# EAGLE design untitled (EAGLE 9.2.2)
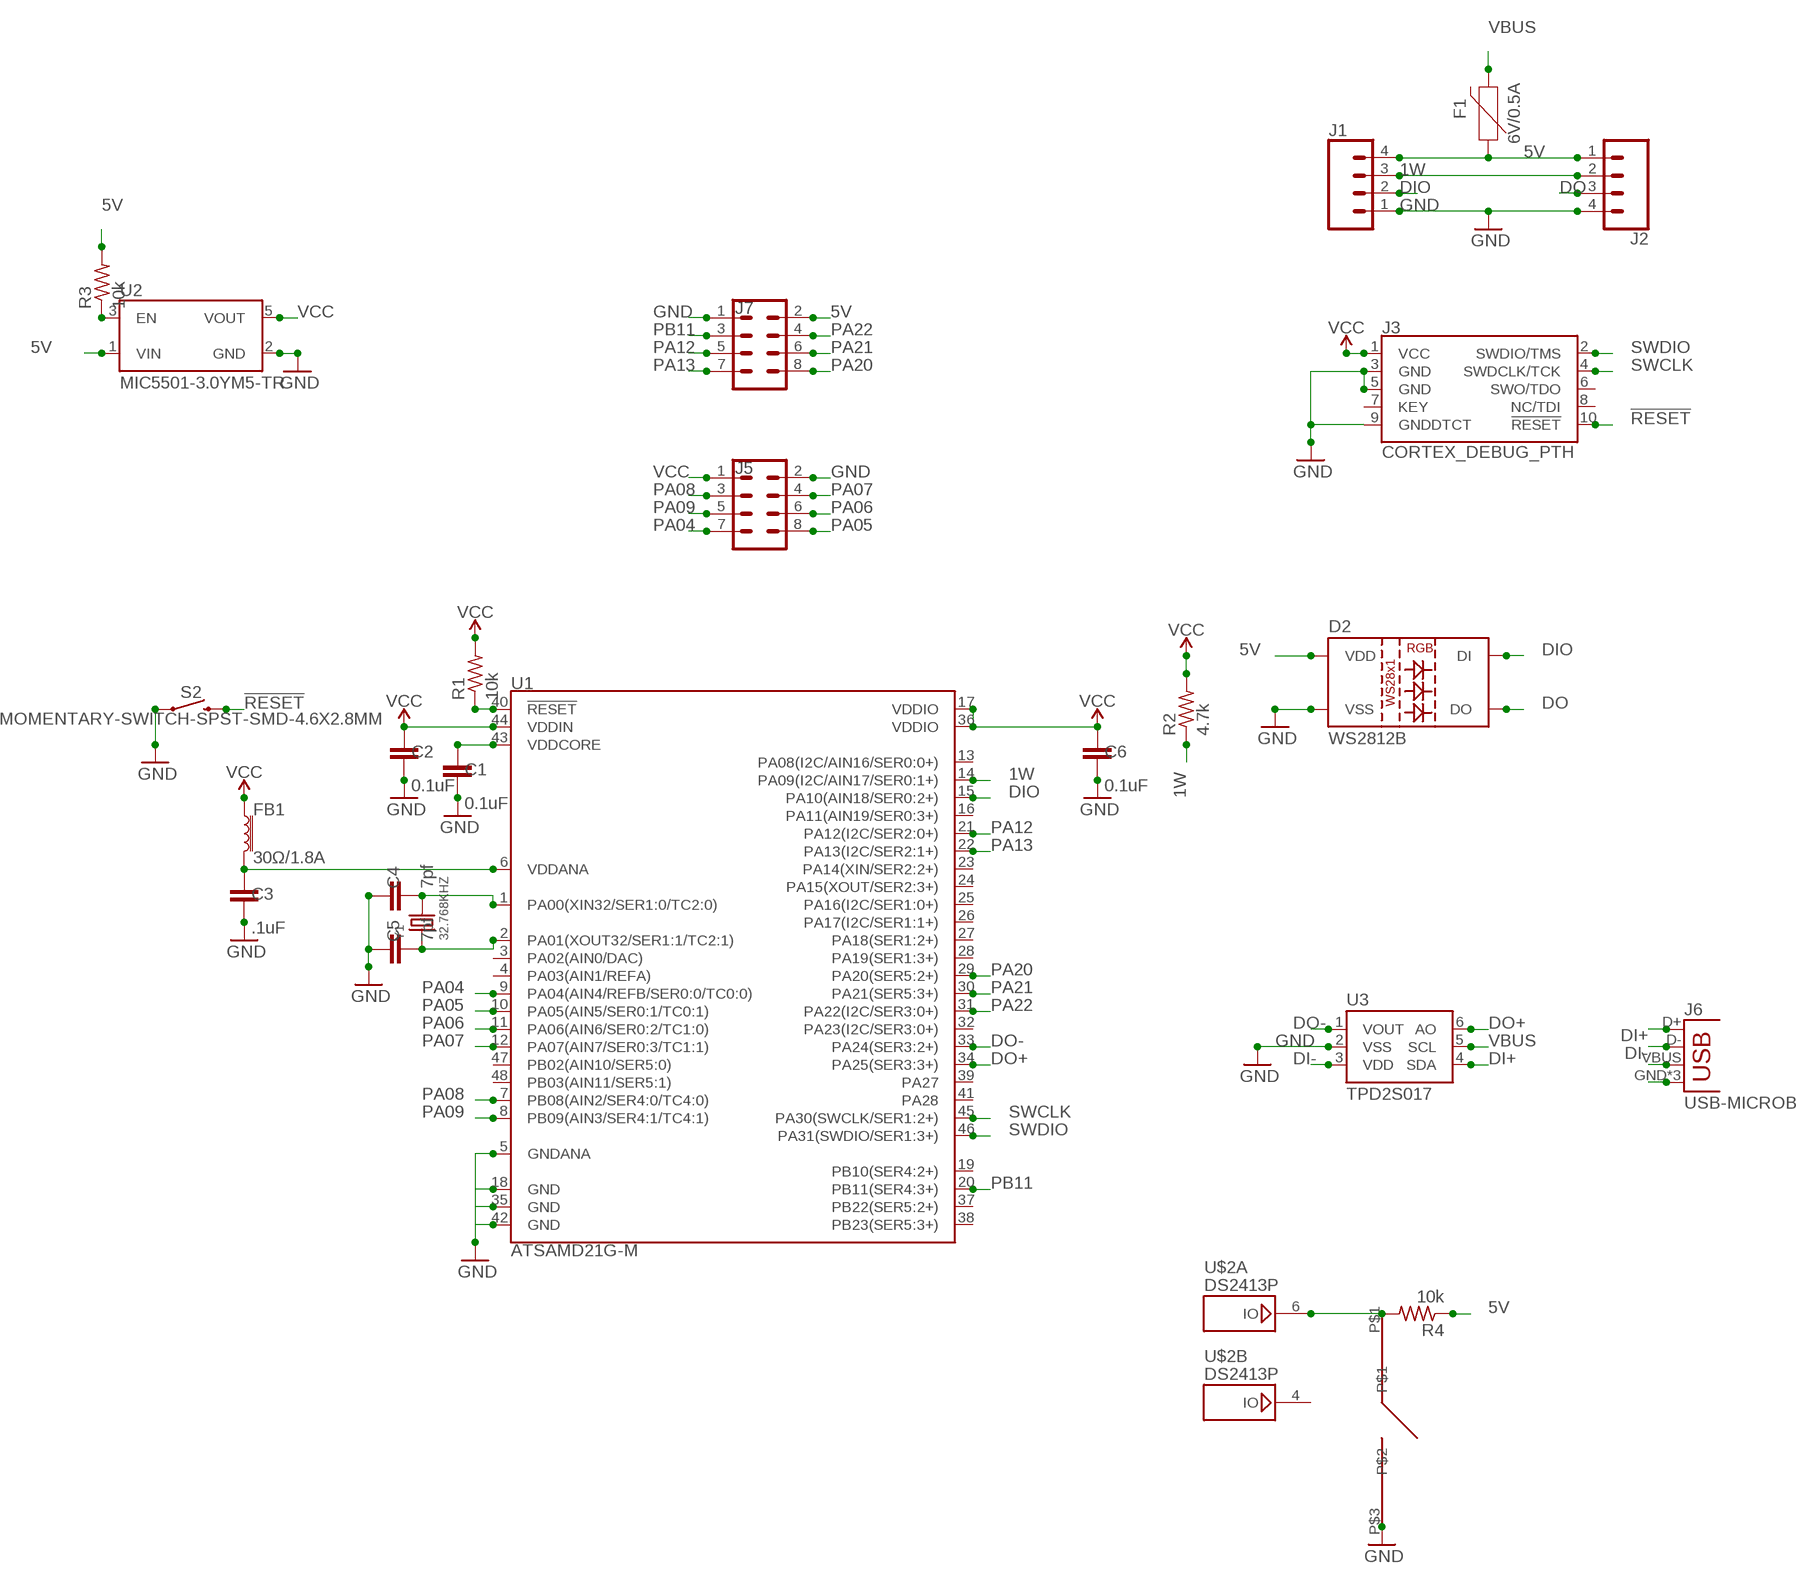
[diagram p0: schematic, sheet 1]

## Parts
C1  0.1uF  0.1UF-0402-16V-10%  [0402]
C2  0.1uF  0.1UF-0402-16V-10%  [0402]
C3  .1uF  0.1UF-0402-16V-10%  [0402]
C4  7pf  0.1UF-0402-16V-10%  [0402]
C5  7pf  0.1UF-0402-16V-10%  [0402]
C6  0.1uF  0.1UF-0402-16V-10%  [0402]
D2  WS2812B  [WS2812B]
F1  6V/0.5A  PPTC_HALF-AMP  [1206]
FB1  30Ω/1.8A  FERRITE_BEAD-0603  [0603]
J1  CONN_04SMD2  [1X04_1MM_RA]
J2  CONN_04SMD2  [1X04_1MM_RA]
J3  CORTEX_DEBUG_PTH  [2X5-PTH-1.27MM]
J5  CONN_04X2  [2X4]
J6  USB-MICROB  [USB-MICROB]
J7  CONN_04X2  [2X4]
R1  10k  R-US_R0402  [R0402]
R2  4.7k  R-US_R0402  [R0402]
R3  10k  R-US_R0402  [R0402]
R4  10k  R-US_R0402  [R0402]
S2  MOMENTARY-SWITCH-SPST-SMD-4.6X2.8MM  [TACTILE_SWITCH_SMD_4.6X2.8MM]
U1  ATSAMD21G-M  [QFN-48]
U2  MIC5501-3.0YM5-TR  [SOT95P280X145-5N]
U3  TPD2S017  MCP4725SOT-23  [SOT23-6]
U$1  NOVELKEY  [NOVELKEY]
U$2  DS2413P  [TSOC6]
Y1  32.768KHZ  SMD-CRYSTAL-ABS07-32.768KHZ-7PF-20PPM-70K(2P-3.2X1.5MM)  [X2-SMD-3.2X1.5X0.55MM]

## Nets
1W: J1.3 J2.2 R2.1 U1.14(PA09(I2C/AIN17/SER0:1+))
5V: D2.1(VDD) F1.1 J1.4 J2.1 J7.2 R3.2 R4.1 U2.1(VIN)
!RESET: J3.10(!RESET) R1.1 S2.3 S2.4 U1.40(!RESET!)
DI+: J6.D+ U3.4(SDA)
DI-: J6.D- U3.3(VDD)
DIO: D2.4(DI) J1.2 U1.15(PA10(AIN18/SER0:2+))
DO: D2.2(DO) J2.3
DO+: U1.34(PA25(SER3:3+)) U3.6(AO)
DO-: U1.33(PA24(SER3:2+)) U3.1(VOUT)
GND: C1.2 C2.2 C3.2 C4.1 C5.1 C6.2 D2.3(VSS) J1.1 J2.4 J3.3(GND) J3.5(GND) J3.9(GNDDTCT) J5.2 J6.GND J6.MT1(GND) J6.MT2(GND) J7.1 S2.1 S2.2 U1.5(GNDANA) U1.18(GND) U1.35(GND) U1.42(GND) U2.2(GND) U3.2(VSS) U$1.P$3
N$1: R3.1 U2.3(EN)
N$4: C3.1 FB1.2 U1.6(VDDANA)
N$10: R4.2 U$1.P$1 U$2.6
N$12: C5.2 U1.2(PA01(XOUT32/SER1:1/TC2:1)) Y1.1
N$13: C4.2 U1.1(PA00(XIN32/SER1:0/TC2:0)) Y1.2
N$14: C1.1 U1.43(VDDCORE)
PA04: J5.7 U1.9(PA04(AIN4/REFB/SER0:0/TC0:0))
PA05: J5.8 U1.10(PA05(AIN5/SER0:1/TC0:1))
PA06: J5.6 U1.11(PA06(AIN6/SER0:2/TC1:0))
PA07: J5.4 U1.12(PA07(AIN7/SER0:3/TC1:1))
PA08: J5.3 U1.7(PB08(AIN2/SER4:0/TC4:0))
PA09: J5.5 U1.8(PB09(AIN3/SER4:1/TC4:1))
PA12: J7.5 U1.21(PA12(I2C/SER2:0+))
PA13: J7.7 U1.22(PA13(I2C/SER2:1+))
PA20: J7.8 U1.29(PA20(SER5:2+))
PA21: J7.6 U1.30(PA21(SER5:3+))
PA22: J7.4 U1.31(PA22(I2C/SER3:0+))
PB11: J7.3 U1.20(PB11(SER4:3+))
SWCLK: J3.4(SWDCLK/TCK) U1.45(PA30(SWCLK/SER1:2+))
SWDIO: J3.2(SWDIO/TMS) U1.46(PA31(SWDIO/SER1:3+))
VBUS: F1.2 J6.VBUS U3.5(SCL)
VCC: C2.1 C6.1 FB1.1 J3.1(VCC) J5.1 R1.2 R2.2 U1.17(VDDIO) U1.36(VDDIO) U1.44(VDDIN) U2.5(VOUT)
Unconnected: J3.6(SWO/TDO) J3.7(KEY) J3.8(NC/TDI) U1.3(PA02(AIN0/DAC)) U1.4(PA03(AIN1/REFA)) U1.13(PA08(I2C/AIN16/SER0:0+)) U1.16(PA11(AIN19/SER0:3+)) U1.19(PB10(SER4:2+)) U1.23(PA14(XIN/SER2:2+)) U1.24(PA15(XOUT/SER2:3+)) U1.25(PA16(I2C/SER1:0+)) U1.26(PA17(I2C/SER1:1+)) U1.27(PA18(SER1:2+)) U1.28(PA19(SER1:3+)) U1.32(PA23(I2C/SER3:0+)) U1.37(PB22(SER5:2+)) U1.38(PB23(SER5:3+)) U1.39(PA27) U1.41(PA28) U1.47(PB02(AIN10/SER5:0)) U1.48(PB03(AIN11/SER5:1)) U$2.4

## Power pins joined to a net without a drawn wire
1W: U$2.2
GND: U$2.1 U$2.5

## Library data of the parts
C1 C2 C6 = SparkFun-Capacitors:0.1UF: 0.1µF ceramic capacitors A capacitor is a passive two-terminal electrical component used to store electrical energy temporarily in an electric field.; PROD_ID: CAP-12416
C3-C5 = SparkFun-Capacitors:0.1UF: 0.1µF ceramic capacitors A capacitor is a passive two-terminal electrical component used to store electrical energy temporarily in an electric field.; PROD_ID: CAP-12416; VALUE: 0.1uF
D2 = SparkFun-LED:WS2812B: WS2812B SMD addressable RGB LED 5x5mm SMD LED with built-in controller IC. Color: Red/Green/Blue mC Rating: RGB: 390, 660, 180 mcd Forward Voltage: RGB: 2.0, 3.0, 3.0 V Packages:WS2812B SparkFun Products: Blynk Board - ESP8266 <https://www.sparkfun.com/products/13794>; PROD_ID: DIO-12503
F1 = SparkFun-Fuses:PPTC: Resettable Fuse PPTC Resettable Fuse. Really a sort of resistor with a polymeric positive temperature coefficient whose resistance increases dramatically with an increase in temperature. When heated by the power passing through the resistance rises causing the current to be limited, protecting the circuit. This is achieved by the transition of the polymer from a crystalline to an amorphous state where the conductive carbon separates breaking the conductive pathways found in the cool crystalline structure. When a PPTC cools back down it resumes conducting letting the circuit turn back on. SparkFun Products: SparkFun RedBoard - Programmed with Arduino <https://www.sparkfun.com/products/12757> Pro Micro - 5V/16MHz <https://www.sparkfun.com/products/12640> Arduino Pro 328 - 5V/16MHz <https://www.sparkfun.com/products/10915> MP3 Trigger <https://www.sparkfun.com/products/13720>; PROD_ID: RES-08585
FB1 = SparkFun-Coils:FERRITE_BEAD: Ferrite Bead (blocks, cores, rings, chokes, etc.) Inductor with layers of ferrite used to suppress high frequencies. Often used to isolate high frequency noise. SparkFun Products: IOIO-OTG - V2.2 <https://www.sparkfun.com/products/13613> SparkFun SAMD21 Mini Breakout <https://www.sparkfun.com/products/13664> SparkFun 6 Degrees of Freedom Breakout - LSM6DS3 <https://www.sparkfun.com/products/13339> SparkFun SAMD21 Dev Breakout <https://www.sparkfun.com/products/13672>; PROD_ID: NDUC-07859
J1 J2 = SparkFun-Connectors:CONN_04: Multi connection point. Often used as Generic Header-pin footprint for 0.1 inch spaced/style header connections On any of the 0.1 inch spaced packages, you can populate with these: Break Away Headers - Straight <https://www.sparkfun.com/products/116> (PRT-00116) Break Away Male Headers - Right Angle <https://www.sparkfun.com/products/553> (PRT-00553) Female Headers <https://www.sparkfun.com/products/115> (PRT-00115) Break Away Headers - Machine Pin <https://www.sparkfun.com/products/117> (PRT-00117) Break Away Female Headers - Swiss Machine Pin <https://www.sparkfun.com/products/743> (PRT-00743) For SCREWTERMINALS and SPRING TERMINALS visit here: Screw Terimnals on SparkFun.com <https://www.sparkfun.com/search/results?term=Screw+Terminals> (5mm/3.5mm/2.54mm spacing) This device is also useful as a general connection point to wire up your design to another part of your project. Our various solder wires solder well into these plated through hole pads. Hook-Up Wire - Assortment (Stranded, 22 AWG) <https://www.sparkfun.com/products/11375> (PRT-11375) Hook-Up Wire - Assortment (Solid Core, 22 AWG) <https://www.sparkfun.com/products/11367> (PRT-11367) View the entire wire category on our website here <https://www.sparkfun.com/categories/141> Special notes: Molex polarized connector foot print use with SKU : PRT-08231 with associated crimp pins and housings. 1MM SMD Version SKU: PRT-10208; PROD_ID: CONN-10310; SF_ID: PRT-10208
J3 = SparkFun-Connectors:CORTEX_DEBUG: Cortex Debug Connector - 10 pin Supports JTAG debug, Serial Wire debug, and Serial Wire Viewer. PTH and SMD connector options available. General Connector Information <http://infocenter.arm.com/help/topic/com.arm.doc.faqs/attached/13634/cortex_debug_connectors.pdf> Products: PTH Connector <http://www.digikey.com/product-detail/en/cnc-tech/3220-10-0100-00/1175-1627-ND/3883661> -via Digi-Key SparkFun PSoc <https://www.sparkfun.com/products/13229> SparkFun T <https://www.sparkfun.com/products/13810>
J5 J7 = SparkFun-Connectors:CONN_04X2: Multi connection point. Often used as Generic Header-pin footprint for 0.1 inch spaced/style header connections On any of the 0.1 inch spaced packages, you can populate with these: Break Away Headers - Straight <https://www.sparkfun.com/products/116> (PRT-00116) Break Away Male Headers - Right Angle <https://www.sparkfun.com/products/553> (PRT-00553) Female Headers <https://www.sparkfun.com/products/115> (PRT-00115) Break Away Headers - Machine Pin <https://www.sparkfun.com/products/117> (PRT-00117) Break Away Female Headers - Swiss Machine Pin <https://www.sparkfun.com/products/743> (PRT-00743)
J6 = SparkFun-Retired:USB: USB Connectors USB-B-PTH is fully proven SKU : PRT-00139/CONN-08278 USB-miniB is fully proven SKU : PRT-00587 USB-A-PCB is untested. USB-A-H is throughly reviewed, but untested. Spark Fun Electronics SKU : PRT-00437 USB-B-SMT is throughly reviewed, but untested. Needs silkscreen touching up. USB-A-S has not been used/tested USB-MB-H has not been used/tested USB-MICROB has been used. CONN-09505; PROD_ID: CONN-09505
R1-R4 = rcl:R-US_: RESISTOR, American symbol; SPICEPREFIX: R
S2 = SparkFun-Switches:MOMENTARY-SWITCH-SPST: Momentary Switch (Pushbutton) - SPST Normally-open (NO) SPST momentary switches (buttons, pushbuttons). Variants PTH-12MM - 12mm square, through-hole Momentary Pushbutton Switch - 12mm Square <https://www.sparkfun.com/products/9190> (COM-09190) PTH-6.0MM, PTH-6.0MM-KIT - 6.0mm square, through-hole Mini Pushbutton Switch <https://www.sparkfun.com/products/97> (COM-00097) KIT package intended for soldering kit's - only one side of pads' copper is exposed. PTH-RIGHT-ANGLE-KIT - Right-angle, through-hole Right Angle Tactile Button <https://www.sparkfun.com/products/10791> - Used on SparkFun BigTime Watch Kit <https://www.sparkfun.com/products/11734> SMD-12MM - 12mm square, surface-mount Tactile Button - SMD (12mm) <https://www.sparkfun.com/products/12993> (COM-12993) Used on SparkFun PicoBoard <https://www.sparkfun.com/products/11888> SMD-4.5MM - 4.5mm Square Trackball Switch Used on SparkFun Blackberry Trackballer Breakout <https://www.sparkfun.com/products/13169> SMD-4.6MMX2.8MM - 4.60mm x 2.80mm, surface mount Used on SparkFun SAMD21 Mini Breakout <https://www.sparkfun.com/products/13664> SMD-5.2MM, SMD-5.2-REDUNDANT - 5.2mm square, surface-mount Mini Pushbutton Switch - SMD <https://www.sparkfun.com/products/8720> (COM-08720) Used on Arduino Pro Mini <https://www.sparkfun.com/products/11114> REDUNDANT package connects both switch circuits together SMD-6.0X3.5MM - 6.0 x 3.5mm, surface mount Momentary Reset Switch SMD <https://www.sparkfun.com/products/8229> (COM-08229) SMD-6.2MM-TALL - 6.2mm square, surface mount Tactile Button - SMD (6mm) <https://www.sparkfun.com/products/12992> Used on SparkFun Digital Sandbox <https://www.sparkfun.com/products/12651> SMD-RIGHT-ANGLE - Right-angle, surface mount Used on SparkFun Block for Intel® Edison - Arduino <https://www.sparkfun.com/products/13036>; PROD_ID: SWCH-13065
U1 = SparkFun-IC-Microcontroller:ATSAMD21G: Atmel SAMD21G SMART ARM-Based Microcontroller The Atmel ® | SMART ™ SAM D21 is a series of low-power microcontrollers using the 32-bit ARM ® Cortex ® -M0+ processor, and ranging from 32- to 64-pins with up to 256KB Flash and 32KB of SRAM. The SAM D21 devices operate at a maximum frequency of 48MHz and reach 2.46 CoreMark/MHz. They are designed for simple and intuitive migration with identical peripheral modules, hex compatible code, identical linear address map and pin compatible migration paths between all devices in the product series. All devices include intelligent and flexible peripherals, Atmel Event System for inter-peripheral signaling, and support for capacitive touch button, slider and wheel user interfaces. Datasheet <https://cdn.sparkfun.com/datasheets/Dev/Arduino/Boards/Atmel-42181-SAM-D21_Datasheet.pdf> SparkFun Products SparkFun SAMD21 Mini Breakout <https://www.sparkfun.com/products/13664> (DEV-13664) SparkFun SAMD21 Dev Breakout <https://www.sparkfun.com/products/13672> (DEV-13672); PROD_ID: IC-13064
U2 = MIC5501-3.0YM5-TR:MIC5501-3.0YM5-TR: General Purpose Single 300mA LDO, 5 SOT-23 T/R; AVAILABILITY: Unavailable; DESCRIPTION: General Purpose Single 300mA LDO, 5 SOT-23 T/R; MF: Microchip; MP: MIC5501-3.0YM5-TR; PACKAGE: SOT-23 Microchip; PRICE: None
U3 = SparkFun-IC-Conversion:MCP4725: MCP4725 DAC Microchip 12-bit I2C DAC, SOT23-6 Datasheet <https://cdn.sparkfun.com/datasheets/BreakoutBoards/MCP4725_2009.pdf> SparkFun Products SparkFun I2C DAC Breakout - MCP4725 <https://www.sparkfun.com/products/12918> (BOB-12918); PROD_ID: IC-08886; VALUE: MCP4725
U$1 = novelkey:NOVELKEY: Novelkey giant MX key
U$2 = 1wire:DS2413: Dual Channel Addressable Switch This chip is similar to the DS2405 chip, but provides two PIO channels with 20mA sinking capability and an on-resistance of 20Ohm for each open drain output. Up to 28V can be switched. Note: Both GND pins must be connected to 0V. Author: Jan Kandziora <jjj@gmx.de>
Y1 = Seeed-Crystal Oscillator:SMD-CRYSTAL-ABS07-32.768KHZ-7PF-20PPM-70K(2P-3.2X1.5MM): 306010055; MPN: FC-135

## Board
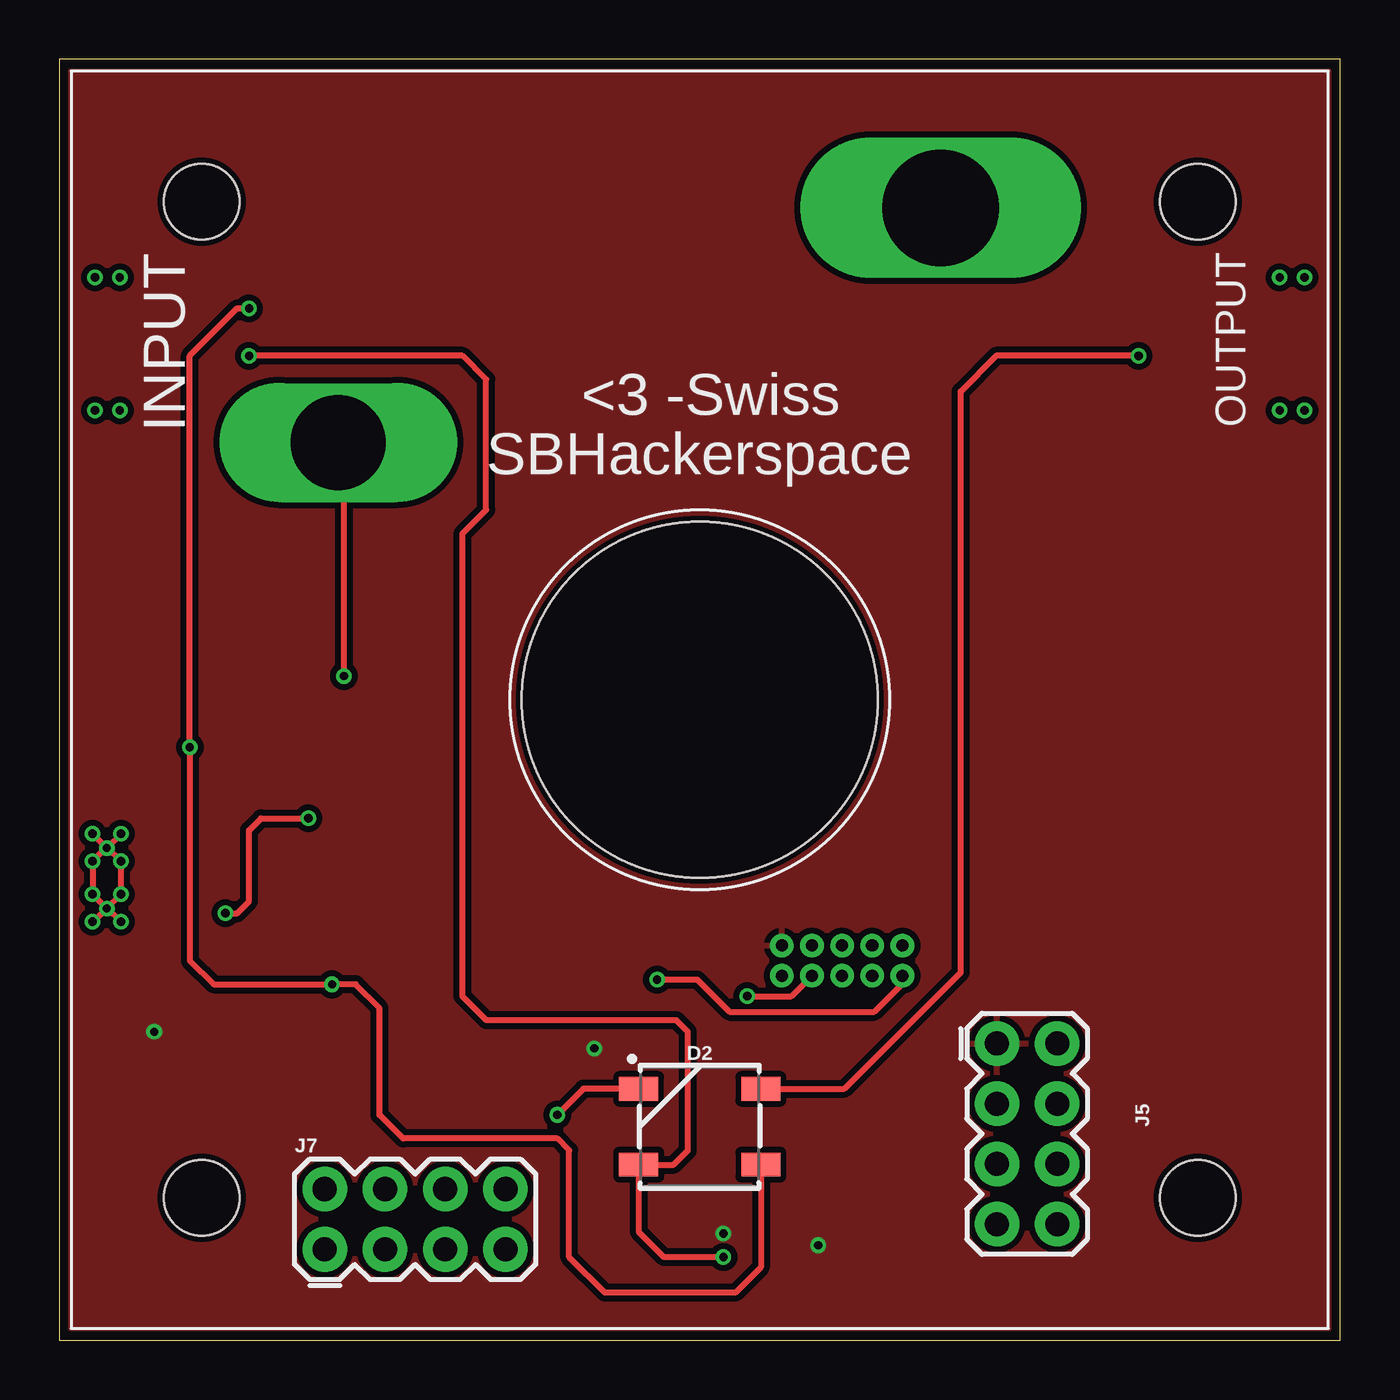
[diagram p1: board, top side]
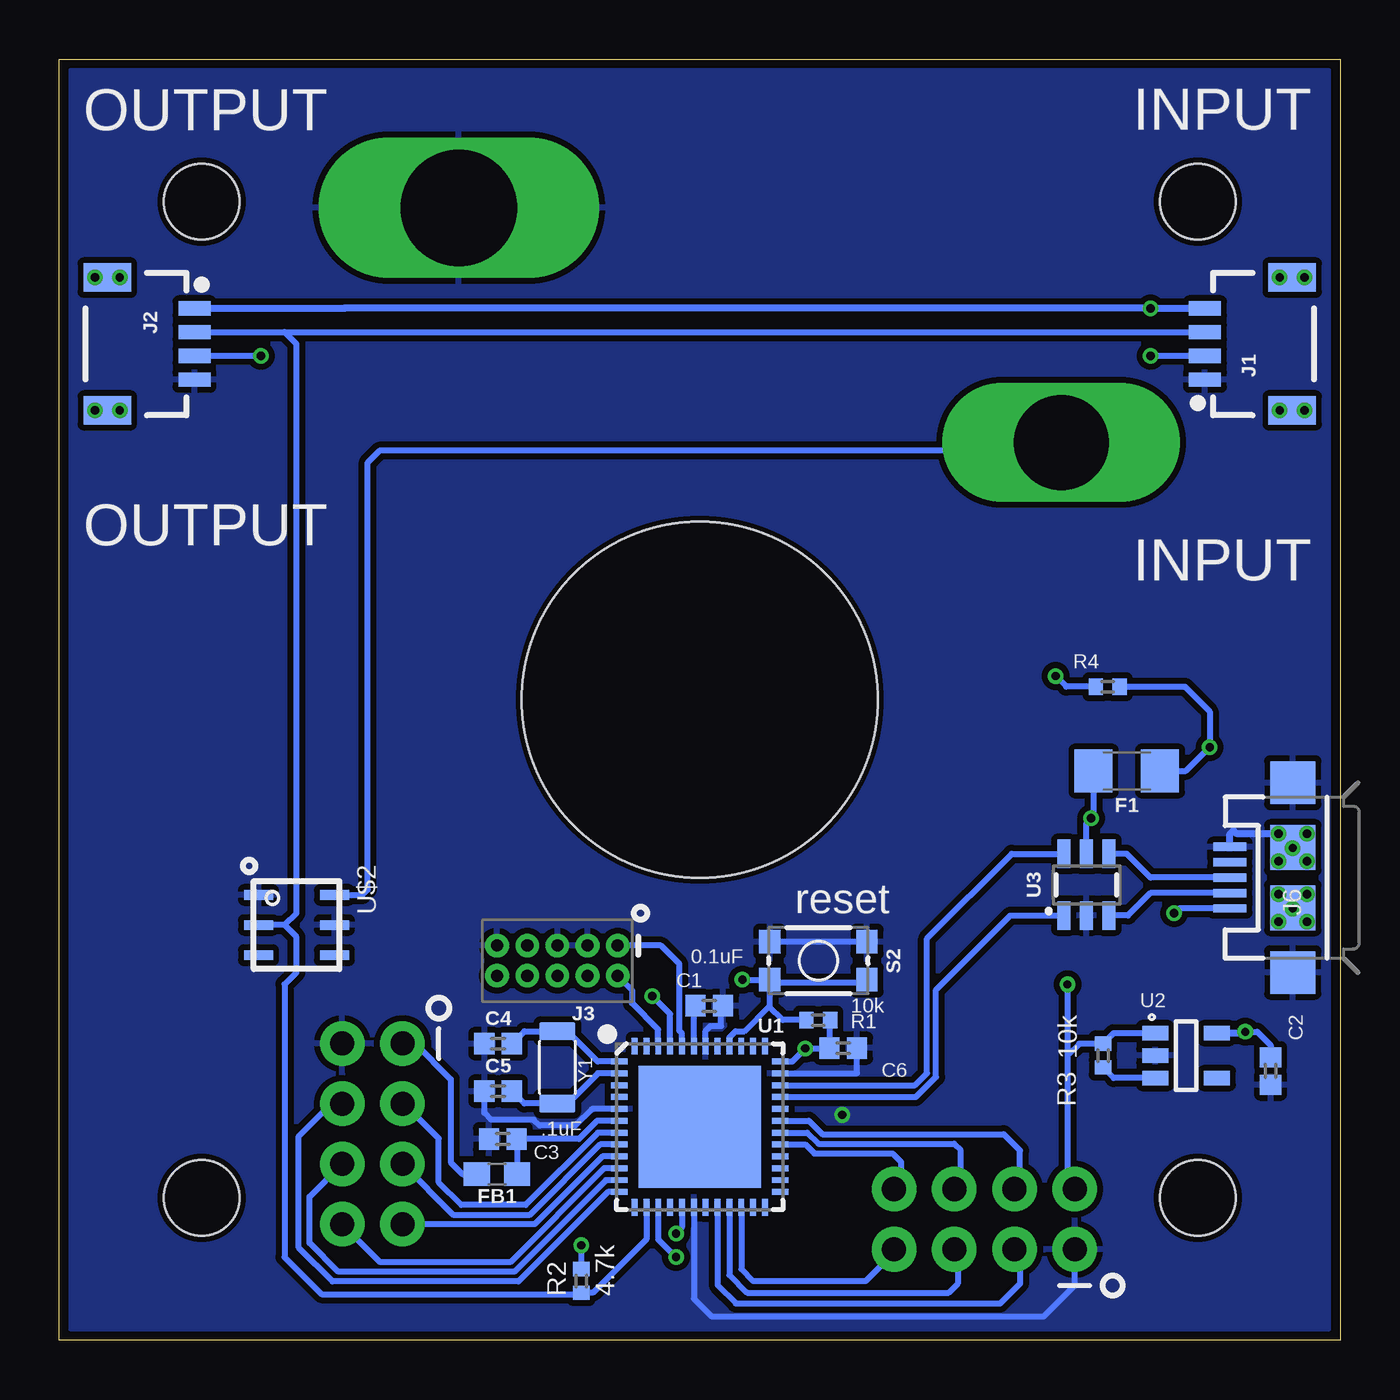
[diagram p2: board, bottom side, seen from below]

Size 54 x 54 mm. Coordinates in mm from the lower left corner, seen from the top.
Outline: 0,0 54,0 54,54 0,54 0,0
Copper layers (1*16): Top 0.035mm / dielectric 1.5mm / Bottom 0.035mm
Design rules "MF_Standard_2_Layer": minimum track width 5mil, minimum drill 12mil, track to track 5mil, track to pad 5mil, pad to pad 5mil, via to via 5mil, smd to smd 0mil, copper to edge 10mil, drill to drill 10mil, minimum pad ring 6mil, minimum via ring 6mil, stop-mask expansion 2mil, vias tented up to drill 25mil, thermal gap 10mil
Holes 3.2 mm at 6,6 48,48 6,48 48,6

### Footprints (pad centres in the part's own frame; a part is rotated, then mirrored left to right if it is on the bottom)
0402 = smd 0.85 x 0.9: 1 -0.58,0; 2 0.58,0
WS2812B = smd 1.651 x 1: 1 2.577,-1.6; 2 2.577,1.6; 3 -2.577,1.6; 4 -2.577,-1.6
1206 = smd 1.6 x 1.8: 1 -1.4,0; 2 1.4,0
0603 = smd 1.1 x 1: 1 -0.85,0; 2 0.85,0
1X04_1MM_RA = smd 0.6 x 1.35: 1 -1.5,0; 2 -0.5,0; 3 0.5,0; 4 1.5,0 | smd 1.2 x 2: NC1 2.8,-3.675; NC2 -2.8,-3.675
2X5-PTH-1.27MM = drill 0.508 pad 1: 1 -2.54,-0.635; 2 -2.54,0.635; 3 -1.27,-0.635; 4 -1.27,0.635; 5 0,-0.635; 6 0,0.635; 7 1.27,-0.635; 8 1.27,0.635; 9 2.54,-0.635; 10 2.54,0.635
2X4 = drill 1.016 pad 1.88: 1 -3.81,-1.27; 2 -3.81,1.27; 3 -1.27,-1.27; 4 -1.27,1.27; 5 1.27,-1.27; 6 1.27,1.27; 7 3.81,-1.27; 8 3.81,1.27
USB-MICROB = smd 0.35 x 1.4: D+ 0,2.65; D- -0.65,2.65; GND 1.3,2.65; ID 0.65,2.65; VBUS -1.3,2.65 | smd 1.8 x 1.9: MT1 -4,0; MT2 4,0 | smd 1.9 x 1.9: P$1 -1.27,0; P$2 1.27,0
R0402 = smd 0.6 x 0.7: 1 -0.5,0; 2 0.5,0
TACTILE_SWITCH_SMD_4.6X2.8MM = smd 0.9 x 1: 1 -2.05,-0.8; 2 2.05,-0.8; 3 2.05,0.8; 4 -2.05,0.8
QFN-48 = smd 0.7 x 0.25: 1 -3.4,2.75; 2 -3.4,2.25; 3 -3.4,1.75; 4 -3.4,1.25; 5 -3.4,0.75; 6 -3.4,0.25; 7 -3.4,-0.25; 8 -3.4,-0.75; 9 -3.4,-1.25; 10 -3.4,-1.75; 11 -3.4,-2.25; 12 -3.4,-2.75; 25 3.4,-2.75; 26 3.4,-2.25; 27 3.4,-1.75; 28 3.4,-1.25; 29 3.4,-0.75; 30 3.4,-0.25; 31 3.4,0.25; 32 3.4,0.75; 33 3.4,1.25; 34 3.4,1.75; 35 3.4,2.25; 36 3.4,2.75 | smd 0.25 x 0.7: 13 -2.75,-3.4; 14 -2.25,-3.4; 15 -1.75,-3.4; 16 -1.25,-3.4; 17 -0.75,-3.4; 18 -0.25,-3.4; 19 0.25,-3.4; 20 0.75,-3.4; 21 1.25,-3.4; 22 1.75,-3.4; 23 2.25,-3.4; 24 2.75,-3.4; 37 2.75,3.4; 38 2.25,3.4; 39 1.75,3.4; 40 1.25,3.4; 41 0.75,3.4; 42 0.25,3.4; 43 -0.25,3.4; 44 -0.75,3.4; 45 -1.25,3.4; 46 -1.75,3.4; 47 -2.25,3.4; 48 -2.75,3.4 | smd 5.15 x 5.15: EP 0,0
SOT95P280X145-5N = smd 1.1 x 0.6: 1 -1.3,0.95; 2 -1.3,0; 3 -1.3,-0.95; 4 1.3,-0.95; 5 1.3,0.95
SOT23-6 = smd 0.55 x 1.2: 1 0.95,1.3; 2 0,1.3; 3 -0.95,1.3; 4 -0.95,-1.3; 5 0,-1.3; 6 0.95,-1.3
NOVELKEY = drill 4 pad 5 long: P$1 -15.24,10.85 | drill 4.9 pad 5.8 long: P$3 10.16,20.74 | hole 15: 0,0
TSOC6 = smd 0.406 x 1.219: 1 -1.27,-1.6; 2 0,-1.6; 3 1.27,-1.6; 4 1.27,1.6; 5 0,1.6; 6 -1.27,1.6
X2-SMD-3.2X1.5X0.55MM = smd 0.762 x 1.524: 1 -1.524,0; 2 1.524,0

### Placement (x,y rotation side)
C1  26.6,14.1 0 bottom
C2  2.94,11.35 270 bottom
C3  35.3,8.48 180 bottom
C4  35.5,12.5 0 bottom
C5  35.5,10.5 0 bottom
C6  20.95,12.31 0 bottom
D2  27,9 0 top
F1  9,24 180 bottom
FB1  35.55,7 0 bottom
J1  5.7,42 90 bottom
J2  48.3,42 270 bottom
J3  33,16 180 bottom
J5  40.8,8.7 270 top
J6  2,19.5 90 bottom
J7  15,5.1 0 top
R1  22,13.5 0 bottom
R2  32,2.5 90 bottom
R3  10,12 90 bottom
R4  9.8,27.55 180 bottom
S2  22,16 180 bottom
U1  27,9 0 bottom
U2  6.5,12 0 bottom
U3  10.7,19.2 180 bottom
U$1  27,27 0 top
U$2  44,17.5 270 bottom
Y1  33,11.5 90 bottom

### Tracks (layer width: path | path; a pad name or v marks a point on that pad's centre or on a via)
1W
  Bottom 0.254: U1.14 29.25,4.25 31.5,2 R2.1 32.06,1.94 42.94,1.94 44.5,3.5 44.5,15 44,15.5 44,17 44.5,17.5 | J2.2 44.5,42.5 | 44.5,42.5 J1.3 | 44.5,17.5 U$2.2 | 44.5,17.5 44,18 44,42 44.5,42.5
5V  (via drill 0.35)
  Top 0.254: D2.1 29.58,3.08 28.5,2 23,2 21.5,3.5 21.5,8 21,8.5 14.5,8.5 13.5,9.5 13.5,14 12.5,15 v11.5,15 6.5,15 5.5,16 v5.5,25 5.5,41.5 7.5,43.5 v8,43.5
  Bottom 0.254: U2.1 9.55,12.95 R3.2 11,12.5 11.5,12 | v11.5,15 11.5,12 | 11.5,12 11.5,6.68 J7.2 | F1.1 6.5,24 v5.5,25 5.5,26.5 6.55,27.55 R4.1
  Bottom 0.305: J1.4 v8,43.5 41.96,43.5 41.98,43.52 48.3,43.52 J2.1
!RESET  (via drill 0.35)
  Top 0.254: J3.10 35.54,15.02 34.36,13.84 28.26,13.84 26.9,15.2 v25.2,15.2
  Bottom 0.254: U1.40 25.75,12.77 25.49,13.03 25.12,13.03 24.07,14.07 | 24.07,14.07 24.05,14.1 S2.3 | v25.2,15.2 S2.3 | S2.3 23.93,15.07 20.07,15.07 S2.4 | R1.1 23.5,13.5 24.07,14.07
DI+
  Bottom 0.254: J6.D+ 8,19.5 9,20.5 U3.4
DI-
  Bottom 0.254: J6.D- 8,18.85 8.95,17.9 U3.3
DIO  (via drill 0.35)
  Top 0.254: v28,3.5 25.5,3.5 24.42,4.58 D2.4 25.9,7.4 26.5,8 26.5,13 26,13.5 18,13.5 17,14.5 17,34 18,35 18,40.5 17,41.5 v8,41.5
  Bottom 0.254: U1.15 28.75,4.25 v28,3.5 | v8,41.5 J1.2
DO  (via drill 0.35)
  Top 0.254: v45.5,41.5 39.5,41.5 38,40 38,15.5 33.1,10.6 D2.2
  Bottom 0.254: J2.3 v45.5,41.5
DO+
  Bottom 0.254: U3.6 13.85,20.5 17.42,16.93 17.42,11.26 17.93,10.75 U1.34
DO-
  Bottom 0.254: U3.1 13.91,17.91 17.04,14.77 17.04,11.1 17.89,10.25 U1.33
GND  (via drill 0.35)
  Top 0.254: v2.6,17.65 2.05,18.2 v2,18.2 | v2,18.2 v2.6,18.8 v2.6,20.2 2.05,20.75 | 2.05,20.75 v2,20.75 | v2,20.75 v1.4,21.35 | v2.6,21.35 2.05,20.8 2.05,20.75 | v2,20.75 1.95,20.75 v1.4,20.2 v1.4,18.8 v2,18.2 | v2,18.2 1.45,17.65 v1.4,17.65 | D2.3 22.1,10.6 v21,9.5
  Bottom 0.254: S2.1 S2.2 | U1.18 27.25,1.75 26.5,1 12.5,1 11.19,2.31 J7.1 | U1.42 26.75,13.05 26.55,13.25 26.1,13.25 26.1,14.02 C1.2 | U1.35 20.37,11.25 C6.2 | U1.5 31.55,9.75 32.25,9.05 33.75,9.05 34,9.3 35.8,9.3 36.08,9.58 C5.1
  Bottom 0.305: J6.GND 4.65,21.35 4.5,21.5 4.35,21.35 v2.6,21.35
  pour Bottom (isolate 0.254): 0.5,53.5 53.5,53.5 53.5,0.5 0.5,0.5
N$1
  Bottom 0.254: U2.3 9.55,11.05 R3.1
N$2  (via drill 0.35)
  other vias: 51.45,39.2
N$3  (via drill 0.35)
  other vias: 52.5,39.2
N$4
  Bottom 0.254: U1.6 31.33,9.25 32.09,8.48 C3.1 34.7,8.46 FB1.2
N$5  (via drill 0.35)
  other vias: 51.45,44.8
N$6  (via drill 0.35)
  other vias: 52.5,44.8
N$7  (via drill 0.35)
  other vias: 1.5,44.8
N$8  (via drill 0.35)
  other vias: 2.55,44.8
N$9  (via drill 0.35)
  other vias: 1.5,39.2
N$10  (via drill 0.35)
  Top 0.254: v12,28 12,37.61 U$1.P$1
  Bottom 0.254: v12,28 11.55,27.55 R4.2 | 12,37.61 U$1.P$1 12.11,37.5 40.5,37.5 41,37 41,19 41.23,18.77 U$2.6
N$11  (via drill 0.35)
  other vias: 2.55,39.2
N$12
  Bottom 0.254: C5.2 34.4,9.98 Y1.1 33,10 32.54,10 31.29,11.25 U1.2
N$13
  Bottom 0.254: U1.1 31.3,11.75 32.57,13.02 Y1.2 34.4,13.02 C4.2
N$14
  Bottom 0.254: U1.43 27.25,14.03 C1.1
PA04
  Bottom 0.254: U1.9 31.1,7.75 33.96,4.89 J5.7
PA05
  Bottom 0.254: U1.10 31.03,7.25 34.98,3.29 40.47,3.29 J5.8
PA06
  Bottom 0.254: U1.11 30.95,6.75 34.81,2.89 42.24,2.89 43.45,4.1 43.45,6.05 J5.6
PA07
  Bottom 0.254: U1.12 30.88,6.25 34.65,2.48 42.48,2.48 43.9,3.9 43.9,8.6 42.5,10 42.1,10 J5.4
PA08
  Bottom 0.254: J5.3 39.47,9.97 38,8.5 38,6.65 37.05,5.7 34.34,5.7 31.29,8.75 U1.7
PA09
  Bottom 0.254: U1.8 31.2,8.25 34.18,5.27 37.37,5.27 J5.5
PA12
  Bottom 0.254: U1.21 25.75,2.75 25,2 16.5,2 16.12,2.38 16.12,3.64
  Bottom 0.305: J7.5 16.12,3.68 16.12,3.64
PA13
  Bottom 0.254: U1.22 25.25,3 24.75,2.5 20,2.5 18.82,3.68
  Bottom 0.305: J7.7 18.82,3.68
PA20
  Bottom 0.254: U1.29 22.55,8.25 22.17,7.87 18.87,7.87 18.5,7.5 18.5,6.66
  Bottom 0.305: J7.8 18.52,6.66 18.5,6.66
PA21
  Bottom 0.254: U1.30 22.47,8.75 22,8.28 16.28,8.28 16,8 16,6.62
  Bottom 0.305: J7.6 16.02,6.62 16,6.62
PA22
  Bottom 0.254: U1.31 22.4,9.25 21.84,8.69 14.19,8.69 13.5,8 13.5,6.58
  Bottom 0.305: J7.4 13.52,6.58 13.5,6.58
PB11
  Bottom 0.254: U1.20 26.25,2.33 25.48,1.55 14.33,1.55 13.5,2.38 13.5,3.56
  Bottom 0.305: J7.3 13.5,3.6 13.5,3.56
SWCLK  (via drill 0.35)
  Top 0.254: v29,14.5 30.86,14.5 J3.4
  Bottom 0.254: v29,14.5 28.25,13.75 U1.45
SWDIO
  Bottom 0.254: U1.46 28.75,13.1 29.86,14.21 29.86,14.77 J3.2
VBUS  (via drill 0.35)
  Top 0.254: v7,18 7.5,18 8,18.5 8,21.5 8.5,22 v10.5,22
  Bottom 0.254: J6.VBUS 6.8,18.2 v7,18 | U3.5 10.7,21.8 v10.5,22 10.4,22.1 F1.2
VCC  (via drill 0.35)
  Bottom 0.254: U1.17 27.75,4.75 v28,4.5 | v32,4 R2.2 | v4,13 3.5,13 2.94,12.44 C2.1 | 21.48,12.27 C6.1 21.53,12.5 | R1.2 21.53,13.47 21.53,12.5 | U1.36 23.1,11.75 v22.55,12.3 21.73,12.3 21.53,12.5 | J5.1 39.01,12.51 37.5,11 37.5,7.5 37,7 FB1.1 | U1.44 27.75,12.94 27.86,13.04 27.86,15.86 28.64,16.64 J3.1
  Bottom 0.305: U2.5 4.05,12.95 v4,13
  pour Top (isolate 0.254): 0.5,53.5 53.5,53.5 53.5,0.5 0.5,0.5

### Text on the board
tNames: <3 -Swiss | INPUT | OUTPUT | SBHackerspace
bNames: INPUT | OUTPUT | INPUT | OUTPUT | reset